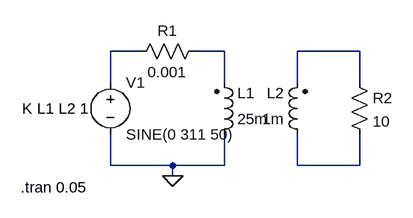
[diagram p0: schematic Lab1_18_01_2024_1.asc]
Lab1_18_01_2024_1.asc, the LTspice schematic file:
Version 4
SHEET 1 880 680
WIRE 16 32 -32 32
WIRE 144 32 96 32
WIRE 352 32 256 32
WIRE -32 80 -32 32
WIRE 144 80 144 32
WIRE 256 80 256 32
WIRE 352 80 352 32
WIRE -32 208 -32 160
WIRE 64 208 -32 208
WIRE 144 208 144 160
WIRE 144 208 64 208
WIRE 256 208 256 160
WIRE 352 208 352 160
WIRE 352 208 256 208
WIRE 64 224 64 208
FLAG 64 224 0
SYMBOL ind2 128 176 M180
WINDOW 0 36 80 Left 2
WINDOW 3 36 40 Left 2
SYMATTR InstName L1
SYMATTR Value 25m
SYMATTR Type ind
SYMBOL ind2 272 176 R180
WINDOW 0 36 80 Left 2
WINDOW 3 36 40 Left 2
SYMATTR InstName L2
SYMATTR Value 1m
SYMATTR Type ind
SYMBOL voltage -32 64 R0
WINDOW 123 0 0 Left 0
WINDOW 39 0 0 Left 0
SYMATTR InstName V1
SYMATTR Value SINE(0 311 50)
SYMBOL res 112 16 R90
WINDOW 0 0 56 VBottom 2
WINDOW 3 32 56 VTop 2
SYMATTR InstName R1
SYMATTR Value 0.001
SYMBOL res 336 64 R0
SYMATTR InstName R2
SYMATTR Value 10
TEXT -168 120 Left 2 !K L1 L2 1
TEXT -170 242 Left 2 !.tran 0.05

The netlist it stands for:
* Lab1_18_01_2024_1.asc
L1 0 N002 25m
L2 N004 N003 1m
V1 N001 0 SINE(0 311 50)
R1 N002 N001 0.001
R2 N003 N004 10
K L1 L2 1
.tran 0.05
.backanno
.end